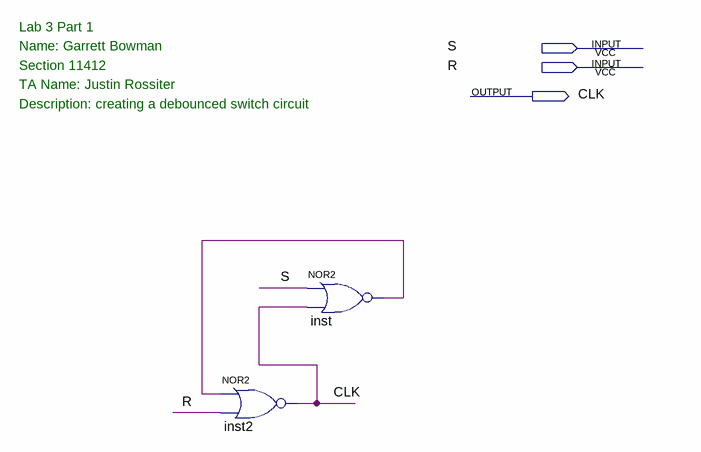
[diagram p0: schematic sheet]
// Quartus schematic Lab3_1.bdf as structural Verilog: 2 symbols, 3 pins
module Lab3_1 (
  input  S,
  input  R,
  output CLK
);

  wire inst_out;

  nor inst2 (CLK, inst_out, R);
  nor inst (inst_out, S, CLK);

  // Notes on the sheet:
  //   Lab 3 Part 1
  //   Name: Garrett Bowman
  //   Section 11412
  //   TA Name: Justin Rossiter
  //   Description: creating a debounced switch circuit
endmodule
